# Altium schematic sheet Power.SchDoc
size A4
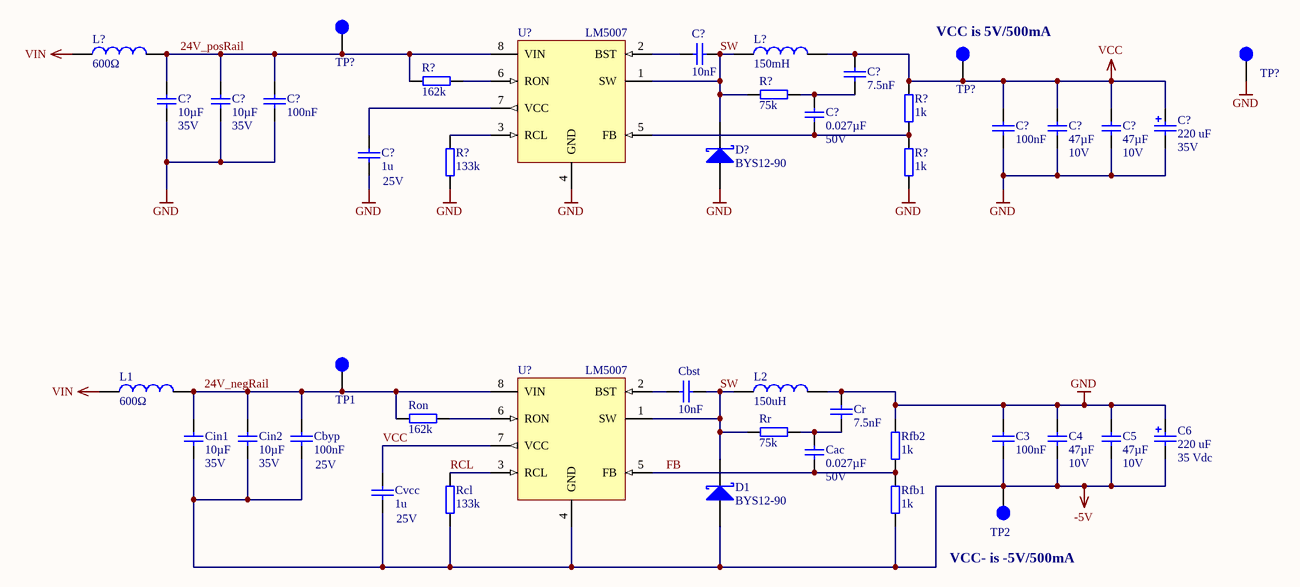
[diagram p0: Power.SchDoc]

## Parts
(Parts that share a designator on the sheet are numbered #1, #2 ... from top to bottom, then left to right.)
C3  100nF  [CAPC1608X07N]
C4  47µF  Voltage: 10V  [C_1206]
C5  47µF  Voltage: 10V  [C_1206]
C6  220 uF  Voltage: 35 Vdc  [WCAP-ATG5_8x11.5x3.5]
C?#1  10nF  [CAPC1608X07N]
C?#2  7.5nF  [CAPC1608X07N]
C?#3  100nF  [CAPC1608X07N]
C?#4  10µF  Voltage: 35V  [C_1206]
C?#5  10µF  Voltage: 35V  [C_1206]
C?#6  0.027µF  Voltage: 50V  [C_1206]
C?#7  100nF  [CAPC1608X07N]
C?#8  1u  Voltage: 25V  [CAPC1608X07N]
C?#9  47µF  Voltage: 10V  [C_1206]
C?#10  47µF  Voltage: 10V  [C_1206]
C?#11  220 uF  Voltage: 35V  [WCAP-ATG5_8x11.5x3.5]
Cac  0.027µF  Voltage: 50V  [C_1206]
Cbst  10nF  [CAPC1608X07N]
Cbyp  100nF  Voltage: 25V  [CAPC1608X07N]
Cin1  10µF  Voltage: 35V  [C_1206]
Cin2  10µF  Voltage: 35V  [C_1206]
Cr  7.5nF  [CAPC1608X07N]
Cvcc  1u  Voltage: 25V  [CAPC1608X07N]
D1  BYS12-90  [DIOM4227X23N]
D?  BYS12-90  [DIOM4227X23N]
L1  600Ω  [WE-CBF_0805_High Current]
L2  150uH  [SMT_inductor_1050_Performance]
L?#1  600Ω  [WE-CBF_0805_High Current]
L?#2  150mH  [SMT_inductor_1050_Performance]
R?#1  162k  [RESC1608X06N]
R?#2  75k  [RESC1608X06N]
R?#3  1k  [RESC1608X06N]
R?#4  133k  [RESC1608X06N]
R?#5  1k  [RESC1608X06N]
Rcl  133k  [RESC1608X06N]
Rfb1  1k  [RESC1608X06N]
Rfb2  1k  [RESC1608X06N]
Ron  162k  [RESC1608X06N]
Rr  75k  [RESC1608X06N]
TP1  Testpoint 1mm  [TP_1mm]  (value not drawn)
TP2  VCC  [TP_1mm]  (value not drawn)
TP?#1  VIN  [TP_1mm]  (value not drawn)
TP?#2  VCC  [TP_1mm]  (value not drawn)
TP?#3  GND  [TP_1mm]  (value not drawn)
U?#1  LM5007  [TSOP65P490X110-8N]
U?#2  LM5007  [TSOP65P490X110-8N]

## Nets
-5V: C3.1 C4.1 C5.1 C6.2(N) Cbyp.2 Cin1.1 Cin2.1 Cvcc.2 D1.2(A) Rcl.1 Rfb1.2 TP2.1 U?#2.4(GND)
GND: C3.2 C4.2 C5.2 C6.1(P) C?#3.2 C?#4.1 C?#5.1 C?#7.1 C?#8.2 C?#9.1 C?#10.1 C?#11.2(N) Cr.1 D?.2(A) L2.2 R?#4.1 R?#5.1 Rfb2.1 TP?#3.1 U?#1.4(GND)
VCC: C?#2.1 C?#7.2 C?#9.2 C?#10.2 C?#11.1(P) Cvcc.1 L?#2.2 R?#3.2 TP?#2.1 U?#2.7(VCC)
VIN: L1.1 L?#1.1
24V_negRail: Cbyp.1 Cin1.2 Cin2.2 L1.2 Ron.2 TP1.1 U?#2.8(VIN)
24V_posRail: C?#3.1 C?#4.2 C?#5.2 L?#1.2 R?#1.1 TP?#1.1 U?#1.8(VIN)
FB: Cac.2 Rfb1.1 Rfb2.2 U?#2.5(FB)
RCL: Rcl.2 U?#2.3(RCL)
SW: C?#1.2 Cbst.1 D1.1(K) D?.1(K) L2.1 L?#2.1 R?#2.1 Rr.2 U?#1.1(SW) U?#2.1(SW)
NetC?#1_1: C?#1.1 U?#1.2(BST)
NetC?#2_2: C?#2.2 C?#6.2 R?#2.2
NetC?#6_1: C?#6.1 R?#3.1 R?#5.2 U?#1.5(FB)
NetC?#8_1: C?#8.1 U?#1.7(VCC)
NetCac_1: Cac.1 Cr.2 Rr.1
NetCbst_2: Cbst.2 U?#2.2(BST)
NetR?#1_2: R?#1.2 U?#1.6(RON)
NetR?#4_2: R?#4.2 U?#1.3(RCL)
NetRon_1: Ron.1 U?#2.6(RON)

## Notes on the sheet
- (near TP?#2) VCC is 5V/500mA
- (near TP2) VCC- is -5V/500mA

## Library data of the parts
C3 = Cap_0603: MPN: 885012206071; MF: Würth; Voltage: 25V; Dielectric: X7R; Tolerance: 10%; Value: 100nF; Supplier 1: Mouser; Supplier 2: *; Supplier Part Number 1: 710-885012206071; Supplier Part Number 2: *; Package: 0603
C4 C5 = C_1206: Capacitor 1206; MPN: GRM31CR61A476ME15L; Tolerance: 20%; MF: Murata Electronics; Dielectric: X5R; Package: 1206; Value: 47µF; Supplier 1: Mouser; Supplier Part Number 1: 81-GRM31CR61A476ME5L
C6 C?#11 = 860020574012: WCAP-ATG5 Aluminum Electrolytic Capacitors, 8x11.5mm, 35 Vdc, 220 uF; MF: Wurth Elektronik; ComponentLink1Description: Manufacturer; ComponentLink1URL: http://www.we-online.de; ComponentLink2Description: Datasheet; ComponentLink2URL: http://katalog.we-online.com/pbs/datasheet/860020574012.pdf; Part Number: 860020574012; Size: 8x11.5mm; Life Cycle: 2000h; Operating Temperature: -40 °C up to +105 °C; Value: 220 uF; MPN: 860020574012; Supplier 1: Mouser; Supplier Part Number 1: 710-860020574012
  C6: Published Date: Apr 2020
  C?#11: Published Date: Sep. 2017
C?#1 Cbst = Cap_0603: MPN: 885012206065; MF: Würth; Voltage: 25V; Dielectric: X7R; Value: 10nF; Supplier 1: Mouser; Supplier Part Number 1: 710-885012206065; Package: 0603
  C?#1: Supplier 2: *; Supplier Part Number 2: *
  Cbst: Supplier 2: Digi-Key; Supplier Part Number 2: 732-7983-1-ND
C?#2 = Cap_0603: MPN: C0603C752J3GACTU; MF: KEMET; Voltage: 25V; Dielectric: C0G; Value: 7.5nF; Supplier 1: Mouser; Supplier 2: *; Supplier Part Number 1: 80-C0603C752J3GACTU; Supplier Part Number 2: *; Package: 0603
C?#3 C?#7 = Cap_0603: MPN: 885012206071; MF: Würth; Voltage: 25V; Dielectric: X7R; Value: 100nF; Supplier 1: Mouser; Supplier 2: *; Supplier Part Number 1: 710-885012206071; Supplier Part Number 2: *; Package: 0603
C?#4 C?#5 = C_1206: Capacitor 1206; MPN: GRM319R6YA106KA12D; Tolerance: 10%; MF: Murata Electronics; Dielectric: X5R; Package: 1206; Value: 10µF; Created: 2018_06_25_AGeiger; Supplier 1: Mouser; Supplier Part Number 1: 81-GRM319R6YA106KA2D
C?#6 Cac = C_1206: Capacitor 1206; MPN: GRM3195C1H273JA01D; Tolerance: 5%; MF: Murata; Dielectric: C0G; Package: 1206; Value: 0.027µF; Supplier 1: Mouser; Supplier Part Number 1: 81-GRM315C1H273JA01D
  C?#6: Created: 2018_06_25_AGeiger
C?#8 Cvcc = Cap_0603: MPN: 885012106022; MF: Würth; Dielectric: X5R; Value: 1u; Supplier 1: Mouser; Supplier Part Number 1: 710-885012106022; Package: 0603
  C?#8: Supplier 2: *; Supplier Part Number 2: *
  Cvcc: Supplier 2: Digi-Key; Supplier Part Number 2: 732-7919-1-ND
C?#9 C?#10 = C_1206: Capacitor 1206; MPN: GRM31CR61A476ME15L; Tolerance: 10%; MF: Murata Electronics; Dielectric: X5R; Package: 1206; Value: 47µF; Created: 2018_06_25_AGeiger; Supplier 1: Mouser; Supplier Part Number 1: 81-GRM31CR61A476ME5L
Cbyp = Cap_0603: MPN: 885012206071; MF: Würth; Tolerance: 10%; Dielectric: X7R; Value: 100nF; Supplier 1: Mouser; Supplier 2: Digi-Key; Supplier Part Number 1: 710-885012206071; Supplier Part Number 2: 732-7989-1-ND; Package: 0603
Cin1 Cin2 = C_1206: Capacitor 1206; MPN: GRT31CC8YA106KE01L; Tolerance: 10%; MF: Murata Electronics; Dielectric: X6S; Package: 1206; Value: 10µF; Supplier 1: Mouser; Supplier Part Number 1: 81-GRT31CC8YA106KE1L
Cr = Cap_0603: MPN: C0603C752J3GACTU; MF: KEMET; Voltage: 25V; Dielectric: C0G; Tolerance: 5%; Value: 7.5nF; Supplier 1: Mouser; Supplier 2: *; Supplier Part Number 1: 80-C0603C752J3GACTU; Supplier Part Number 2: *; Package: 0603
D1 D? = BYS12-90: Schottky Diode; MPN: BYS12-90-E3/TR3; MF: Vishay; Forward Voltage: 750mV; Reverse Voltage: 90V; Rated Current: 1.5A; Package: DO-214AC; Supplier 1: Farnell; Supplier 2: Mouser; Supplier 3: Digi-Key; Supplier Part Number 1: 2889144; Supplier Part Number 2: 625-BYS12-90-E3/TR3; Supplier Part Number 3: BYS12-90-E3/GICT-ND
L1 L?#1 = WE-CBF, 742792040: WE-CBF SMD EMI Suppression Ferrite Bead, 0805, 600Ω; MF: Wurth Elektronik; Type: High Current; ComponentLink1Description: Manufacturer; ComponentLink1URL: http://www.we-online.de; ComponentLink2Description: Datasheet; ComponentLink2URL: http://katalog.we-online.de/pbs/datasheet/742792040.pdf; MPN: 742792040; Value: 600Ω; Size: 0805; Supplier 1: Farnell; Supplier 2: Mouser; Supplier 3: Digi-Key; Supplier Part Number 2: 710-742792040; Supplier Part Number 3: 732-1620-1-ND
  L1: PublishedDate: Apr 2020; Supplier Part Number 1: 1635735
  L?#1: PublishedDate: Aug 2016; Supplier Part Number 1: 2761567
L2 = B82464G4154M: SMT power Inductor, 150uH, 320m DRC; MF: EPCOS / TDK; Rated Current: 0.85 A; Tolerance: 20%; MPN: B82464G4154M; Supplier 1: Mouser; Supplier Part Number 1: 871-B82464G4154M; Value: 150uH; DCR: 320m
L?#2 = B82464G4154M: SMT power Inductor, 150uH, 320m DRC; MF: EPCOS / TDK; Rated Current: 0.85 A; MPN: B82464G4154M; Supplier 1: Mouser; Supplier Part Number 1: 871-B82464G4154M; Value: 150mH; DCR: 320m
R?#1 Ron = R_0603: MPN: CR0603-FX-1623ELF; MF: Bourns; Value: 162k; Supplier 1: Mouser; Supplier Part Number 1: 652-CR0603-FX1623ELF; Package: 0603
R?#2 Rr = R_0603: MPN: AC0603FR-1375KL; MF: Yageo; Value: 75k; Supplier 1: Mouser; Supplier Part Number 1: 603-AC0603FR-1375KL; Package: 0603
R?#3 R?#5 = R_0603: MPN: CRCW06031K00JNEAC; MF: Vishay / Dale; Value: 1k; Supplier 1: Mouser; Supplier Part Number 1: 71-CRCW06031K00JNEAC; Package: 0603
R?#4 Rcl = R_0603: MPN: CR0603-FX-1333ELF; MF: Bourns; Value: 133k; Supplier 1: Mouser; Supplier Part Number 1: 652-CR0603FX-1333ELF; Package: 0603
Rfb1 Rfb2 = R_0603: MPN: CRCW06031K00JNEAC; MF: Vishay / Dale; Tolerance: 5%; Value: 1k; Supplier 1: Mouser; Supplier Part Number 1: 71-CRCW06031K00JNEAC; Package: 0603
TP1 = TP_1mm: Value: Testpoint 1mm
TP2 TP?#1-TP?#3 = TP_1mm: Testpoint 1mm; Created: 2018_06_25_AGeiger; Value: Testpoint 1mm
U?#1 U?#2 = LM5007: Buck Converter, 9-75Vin, 2.5-73Vout; MPN: LM5007MM/NOPB; MF: Texas Instruments; Supplier 1: Farnell; Supplier 2: Mouser; Supplier 3: Digi-Key; Supplier Part Number 1: 9779345; Supplier Part Number 2: 926-LM5007MM/NOPB; Supplier Part Number 3: LM5007MM/NOPBCT-ND; Package: VSSOP-8